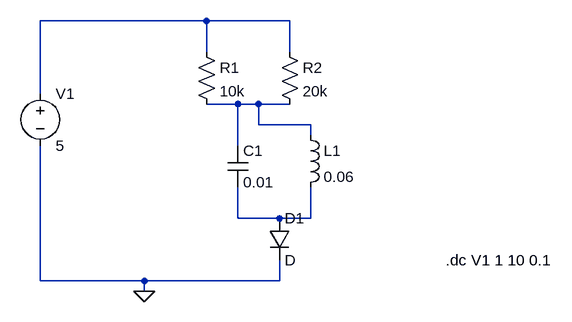
[diagram p0: schematic LT_VERSION_4_1.asc]
LT_VERSION_4_1.asc, the LTspice schematic file:
Version 4.1
SHEET 1 880 680
WIRE 272 16 16 16
WIRE 400 16 272 16
WIRE 272 64 272 16
WIRE 400 64 400 16
WIRE 16 128 16 16
WIRE 320 144 272 144
WIRE 352 144 320 144
WIRE 400 144 352 144
WIRE 352 176 352 144
WIRE 432 176 352 176
WIRE 432 192 432 176
WIRE 320 208 320 144
WIRE 320 320 320 272
WIRE 384 320 320 320
WIRE 432 320 432 272
WIRE 432 320 384 320
WIRE 16 416 16 208
WIRE 176 416 16 416
WIRE 384 416 384 384
WIRE 384 416 176 416
WIRE 176 432 176 416
FLAG 176 432 0
SYMBOL voltage 16 112 R0
WINDOW 123 0 0 Left 0
WINDOW 39 0 0 Left 0
SYMATTR InstName V1
SYMATTR Value 5
SYMBOL res 256 48 R0
SYMATTR InstName R1
SYMATTR Value 10k
SYMBOL res 384 48 R0
SYMATTR InstName R2
SYMATTR Value 20k
SYMBOL cap 304 208 R0
SYMATTR InstName C1
SYMATTR Value 0.01
SYMBOL ind 416 176 R0
SYMATTR InstName L1
SYMATTR Value 0.06
SYMATTR SpiceLine Rser=1m
SYMBOL diode 368 320 R0
SYMATTR InstName D1
TEXT 640 384 Left 2 !.dc V1 1 10 0.1

The netlist it stands for:
* LT_VERSION_4_1.asc
V1 N001 0 5
R1 N001 N002 10k
R2 N001 N002 20k
C1 N002 N003 0.01
L1 N002 N003 0.06 Rser=1m
D1 N003 0 D
.model D D
.lib standard.dio
.dc V1 1 10 0.1
.backanno
.end